# EasyEDA schematic SCH_glow_cube_v2_2023-04-08.json
TITLE: Sheet_1; REV: 1.0; Date: 2023-03-22; Sheet: 1/1; Drawn By: xiaocainiao233; Company: Your Company
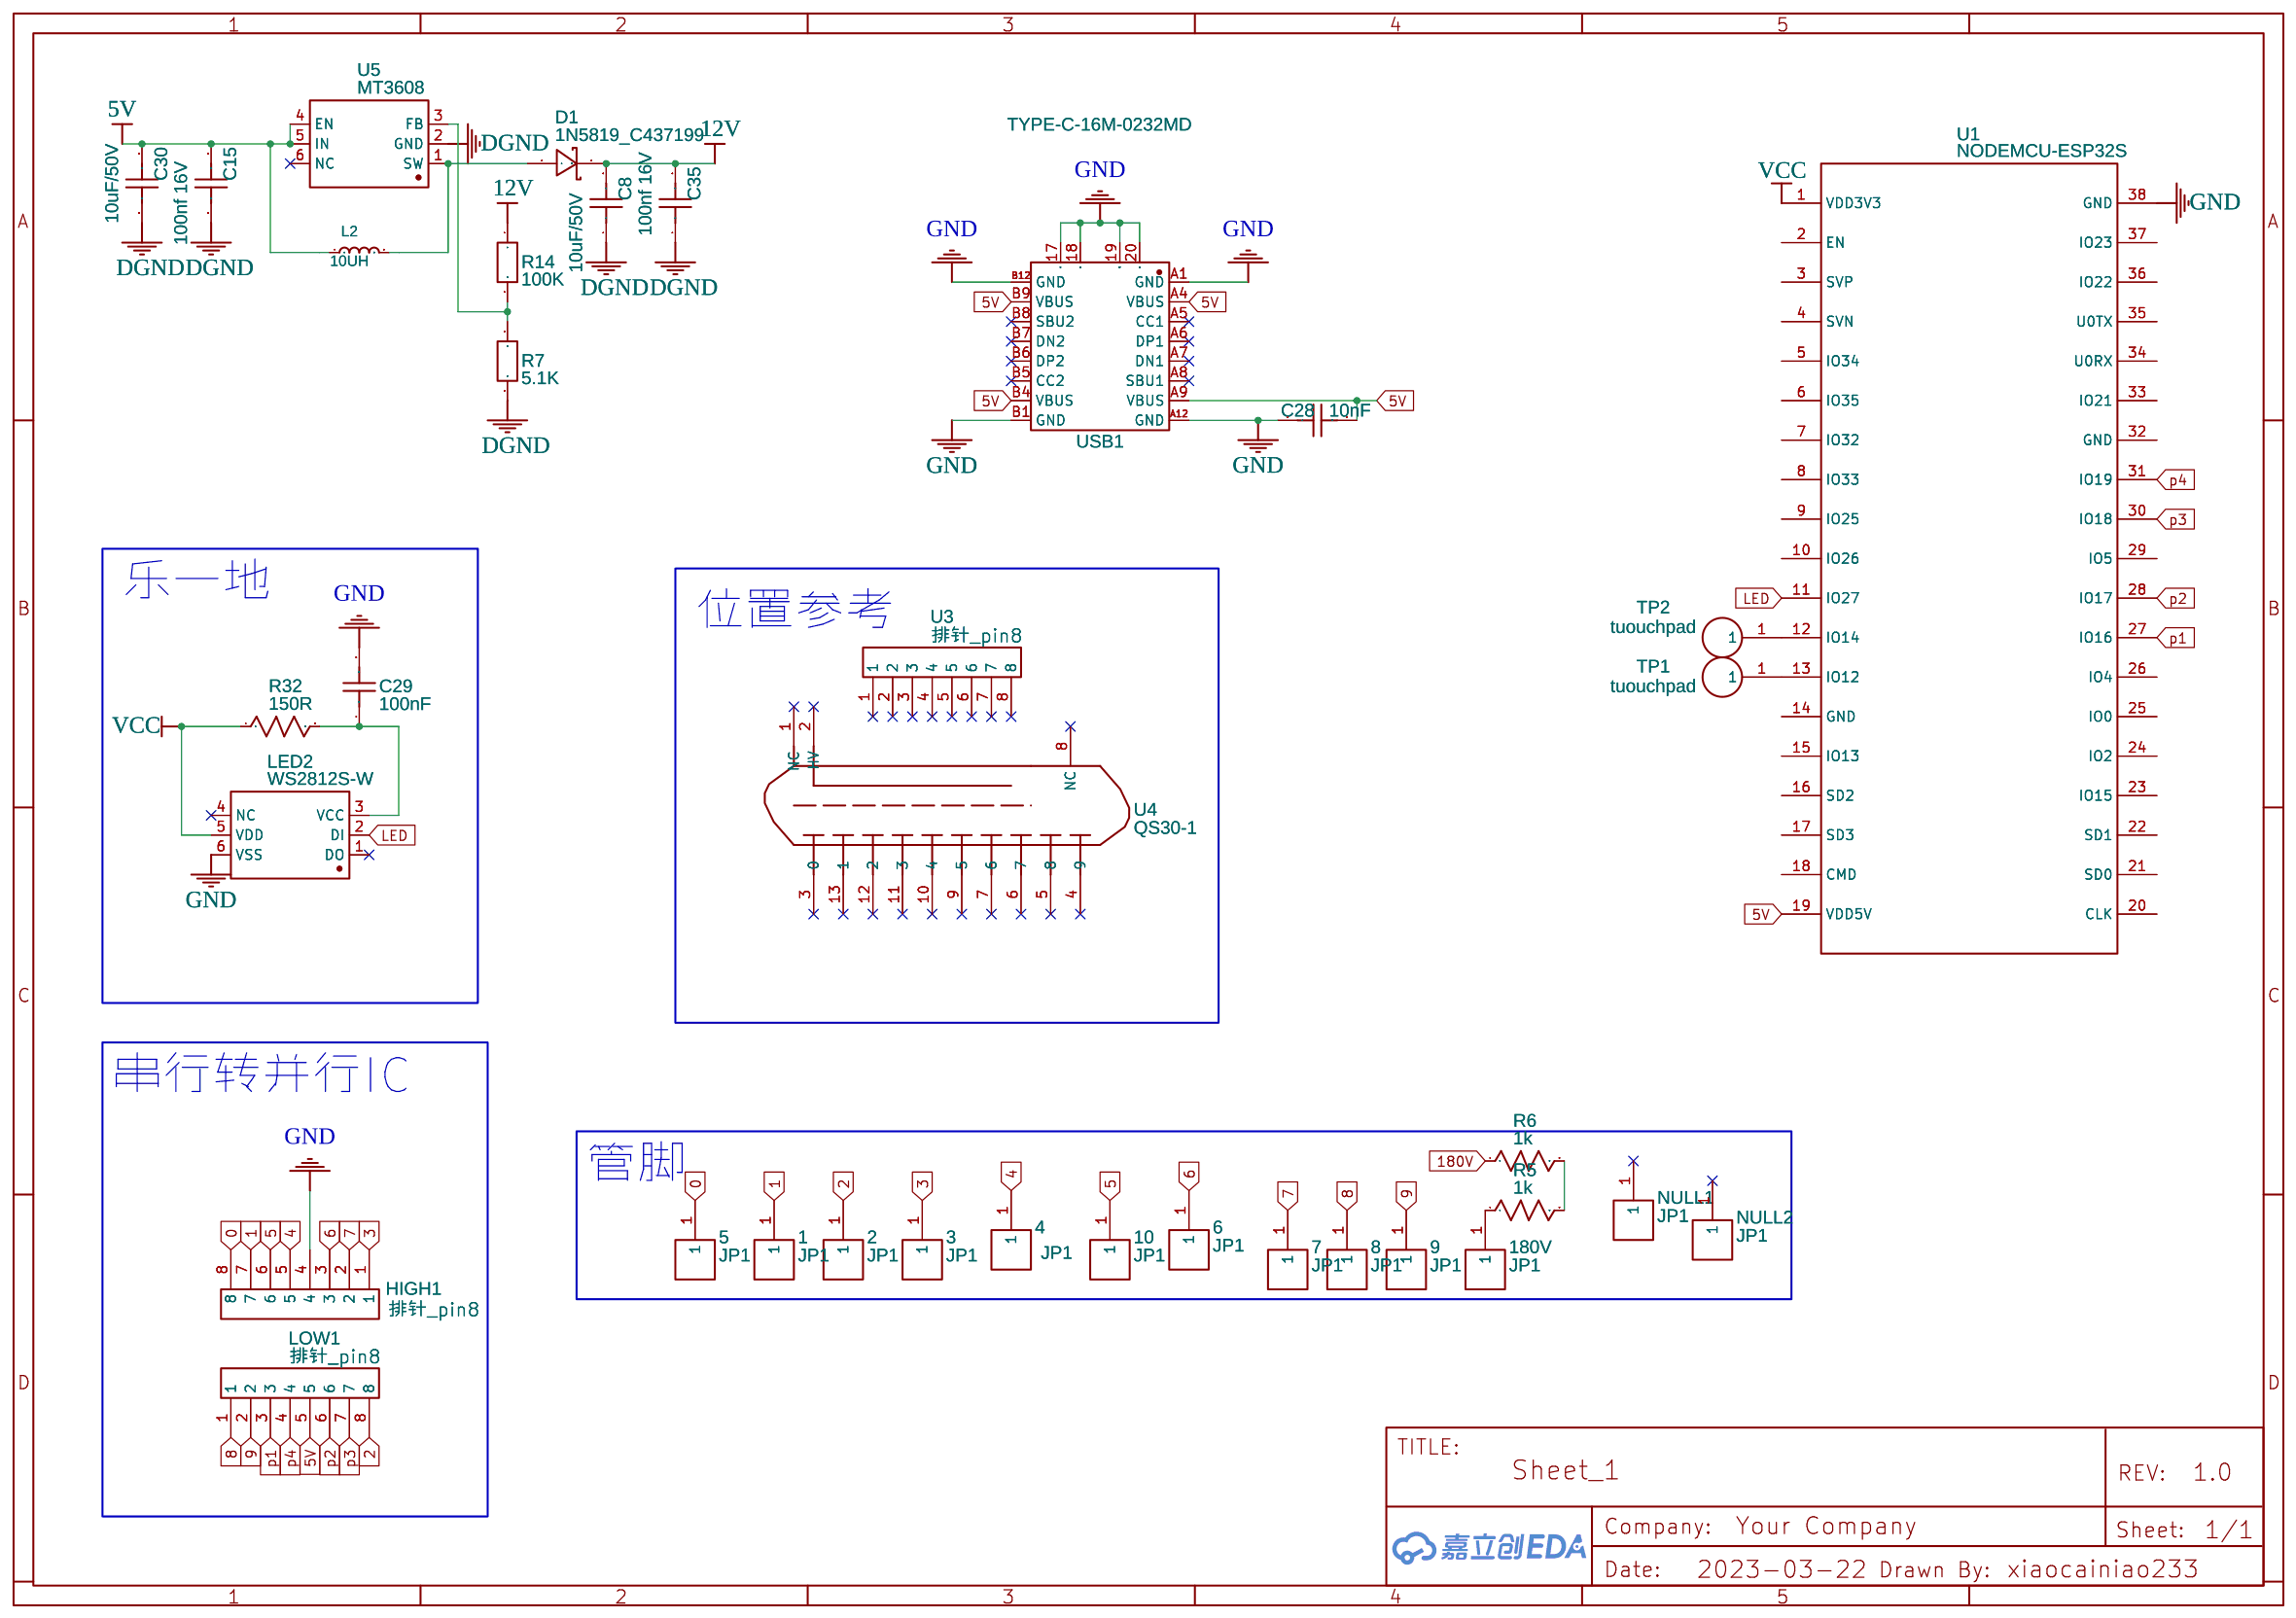
[diagram p0: schematic sheet]

## Parts
1  JP1  [排针1P]
2  JP1  [排针1P]
3  JP1  [排针1P]
4  JP1  [排针1P]
5  JP1  [排针1P]
6  JP1  [排针1P]
7  JP1  [排针1P]
8  JP1  [排针1P]
9  JP1  [排针1P]
10  JP1  [排针1P]
180V  JP1  [排针1P]
C8  10uF/50V  [R0603]
C15  100nf 16V  [R0603]
C28  10nF  [C0603]
C29  100nF  [C0402]
C30  10uF/50V  [R0603]
C35  100nf 16V  [R0603]
D1  1N5819_C437199  [SMA_L4.4-W2.6-LS5.0-RD]
HIGH1  排针_pin8  [排针8PIN]
L2  10UH  [PAN_22UH]
LED2  WS2812S-W  [LED-SMD_6P-L5.0-W5.0-TL]
LOW1  排针_pin8  [排针8PIN]
NULL1  JP1  [排针1P]
NULL2  JP1  [排针1P]
R5  1k  [R_AXIAL-0.3]
R6  1k  [R_AXIAL-0.3]
R7  5.1K  [R0603]
R14  100K  [R0603]
R32  150R  [R0603]
TP1  tuouchpad  [TOUCHPAD]
TP2  tuouchpad  [TOUCHPAD]
U1  NODEMCU-ESP32S  [NODEMCD-ESP32S]
U3  排针_pin8  [排针8PIN]
U4  QS30-1  [QS30-1管座]
U5  MT3608  [SOT-23-6_L2.9-W1.6-P0.95-LS2.8-BR]
USB1  TYPE-C-16M-0232MD  [USB-C-SMD_TYPE-611-T3-W]

## Library data of the parts
1-10 180V NULL1 NULL2 = JP1: Contributor: 爱永无悔
C8 C30 = C_0805_US: Contributor: LCEDA_Lib
C15 C28 C35 = C_0603_US: Contributor: LCEDA_Lib
C29 = C_0402_US: Contributor: LCEDA_Lib
D1 = 1N5819_C437199: Supplier: LCSC; Supplier Part: C437199; Manufacturer: KEXIN(科信); Manufacturer Part: 1N5819; Contributor: LCSC; JLCPCB Part Class: Extended Part
HIGH1 LOW1 U3 = 排针_pin8: Contributor: lhsy
L2 = -: Datasheet: https://www.bourns.com/docs/Product-Datasheets/SRN6045.pdf; MPN: NR6045T330M
LED2 = WS2812S-W: Supplier: LCSC; Manufacturer: worldsemi; Manufacturer Part: WS2812S; Contributor: LCSC; Supplier Part: C114584; JLCPCB Part Class: Extended Part
R5 R6 = R_AXIAL-0.3_US: Contributor: LCEDA_Lib
R7 R14 = R_0603_EU: Contributor: LCEDA_Lib
R32 = R_0603_US: Contributor: LCEDA_Lib
TP1 TP2 = tuouchpad: Contributor: lg28870983
U1 = NODEMCU-ESP32S: Contributor: opendragonhuang
U4 = QS30-1: Contributor: dujiaoxi
U5 = MT3608: Supplier: LCSC; Manufacturer: AEROSEMI; Supplier Part: C84817; JLCPCB Part Class: Extended Part
USB1 = TYPE-C-16M-0232MD: Supplier: LCSC; Supplier Part: C2798171; Manufacturer: USAKRO(美韩); Contributor: LCSC; JLCPCB Part Class: Extended Part

## Nets
5V: C15.2 C28.2 C30.2 L2.1 LOW1.5 U1.19(VDD5V) U5.4(EN) U5.5(IN) USB1.A4(VBUS) USB1.A9(VBUS) USB1.B4(VBUS) USB1.B9(VBUS)
12V: C8.2 C35.2 D1.1(C) R14.1
180V: R6.1
DGND: C8.1 C15.1 C30.1 C35.1 R7.2 U5.2(GND)
GND: C28.1 C29.2 HIGH1.4 LED2.6(VSS) U1.38(GND) USB1.17 USB1.18 USB1.19 USB1.20 USB1.A1(GND) USB1.A12(GND) USB1.B1(GND) USB1.B12(GND)
VCC: LED2.5(VDD) R32.1 U1.1(VDD3V3)
0: 5.1 HIGH1.8
1: 1.1 HIGH1.7
2: 2.1 LOW1.8
3: 3.1 HIGH1.1
4: 4.1 HIGH1.5
5: 10.1 HIGH1.6
6: 6.1 HIGH1.3
7: 7.1 HIGH1.2
8: 8.1 LOW1.1
9: 9.1 LOW1.2
LED: LED2.2(DI) U1.11(IO27)
p1: LOW1.3 U1.27(IO16)
p2: LOW1.6 U1.28(IO17)
p3: LOW1.7 U1.30(IO18)
p4: LOW1.4 U1.31(IO19)
Net-(180V-1): 180V.1 R5.1
Net-(C29-1): C29.1 LED2.3(VCC) R32.2
Net-(D1-2): D1.2(A) L2.2 U5.1(SW)
Net-(R5-2): R5.2 R6.2
Net-(R7-1): R7.1 R14.2 U5.3(FB)
Net-(TP1-1): TP1.1 U1.13(IO12)
Net-(TP2-1): TP2.1 U1.12(IO14)

Not connected (* = marked no-connect by the designer): LED2 1(DO)* 4(NC)*; NULL1 1*; NULL2 1*; U1 2(EN) 3(SVP) 4(SVN) 5(IO34) 6(IO35) 7(IO32) 8(IO33) 9(IO25) 10(IO26) 14(GND) 15(IO13) 16(SD2) 17(SD3) 18(CMD) 20(CLK) 21(SD0) 22(SD1) 23(IO15) 24(IO2) 25(IO0) 26(IO4) 29(IO5) 32(GND) 33(IO21) 34(U0RX) 35(U0TX) 36(IO22) 37(IO23); U3 1* 2* 3* 4* 5* 6* 7* 8*; U4 1(NC)* 2(HV)* 3(0)* 4(9)* 5(8)* 6(7)* 7(6)* 8(NC)* 9(5)* 10(4)* 11(3)* 12(2)* 13(1)*; U5 6(NC)*; USB1 A5(CC1)* A6(DP1)* A7(DN1)* A8(SBU1)* B5(CC2)* B6(DP2)* B7(DN2)* B8(SBU2)*

## Notes on the sheet
- 乐一地
- 位置参考
- 串行转并行IC
- 管脚
